# EasyEDA schematic SCH_cherry1_2026-04-12.json
TITLE: Sheet_1; REV: 1.0; Date: 2026-04-12; Sheet: 1/1; Drawn By: eda_wlhfflwl; Company: Your Company
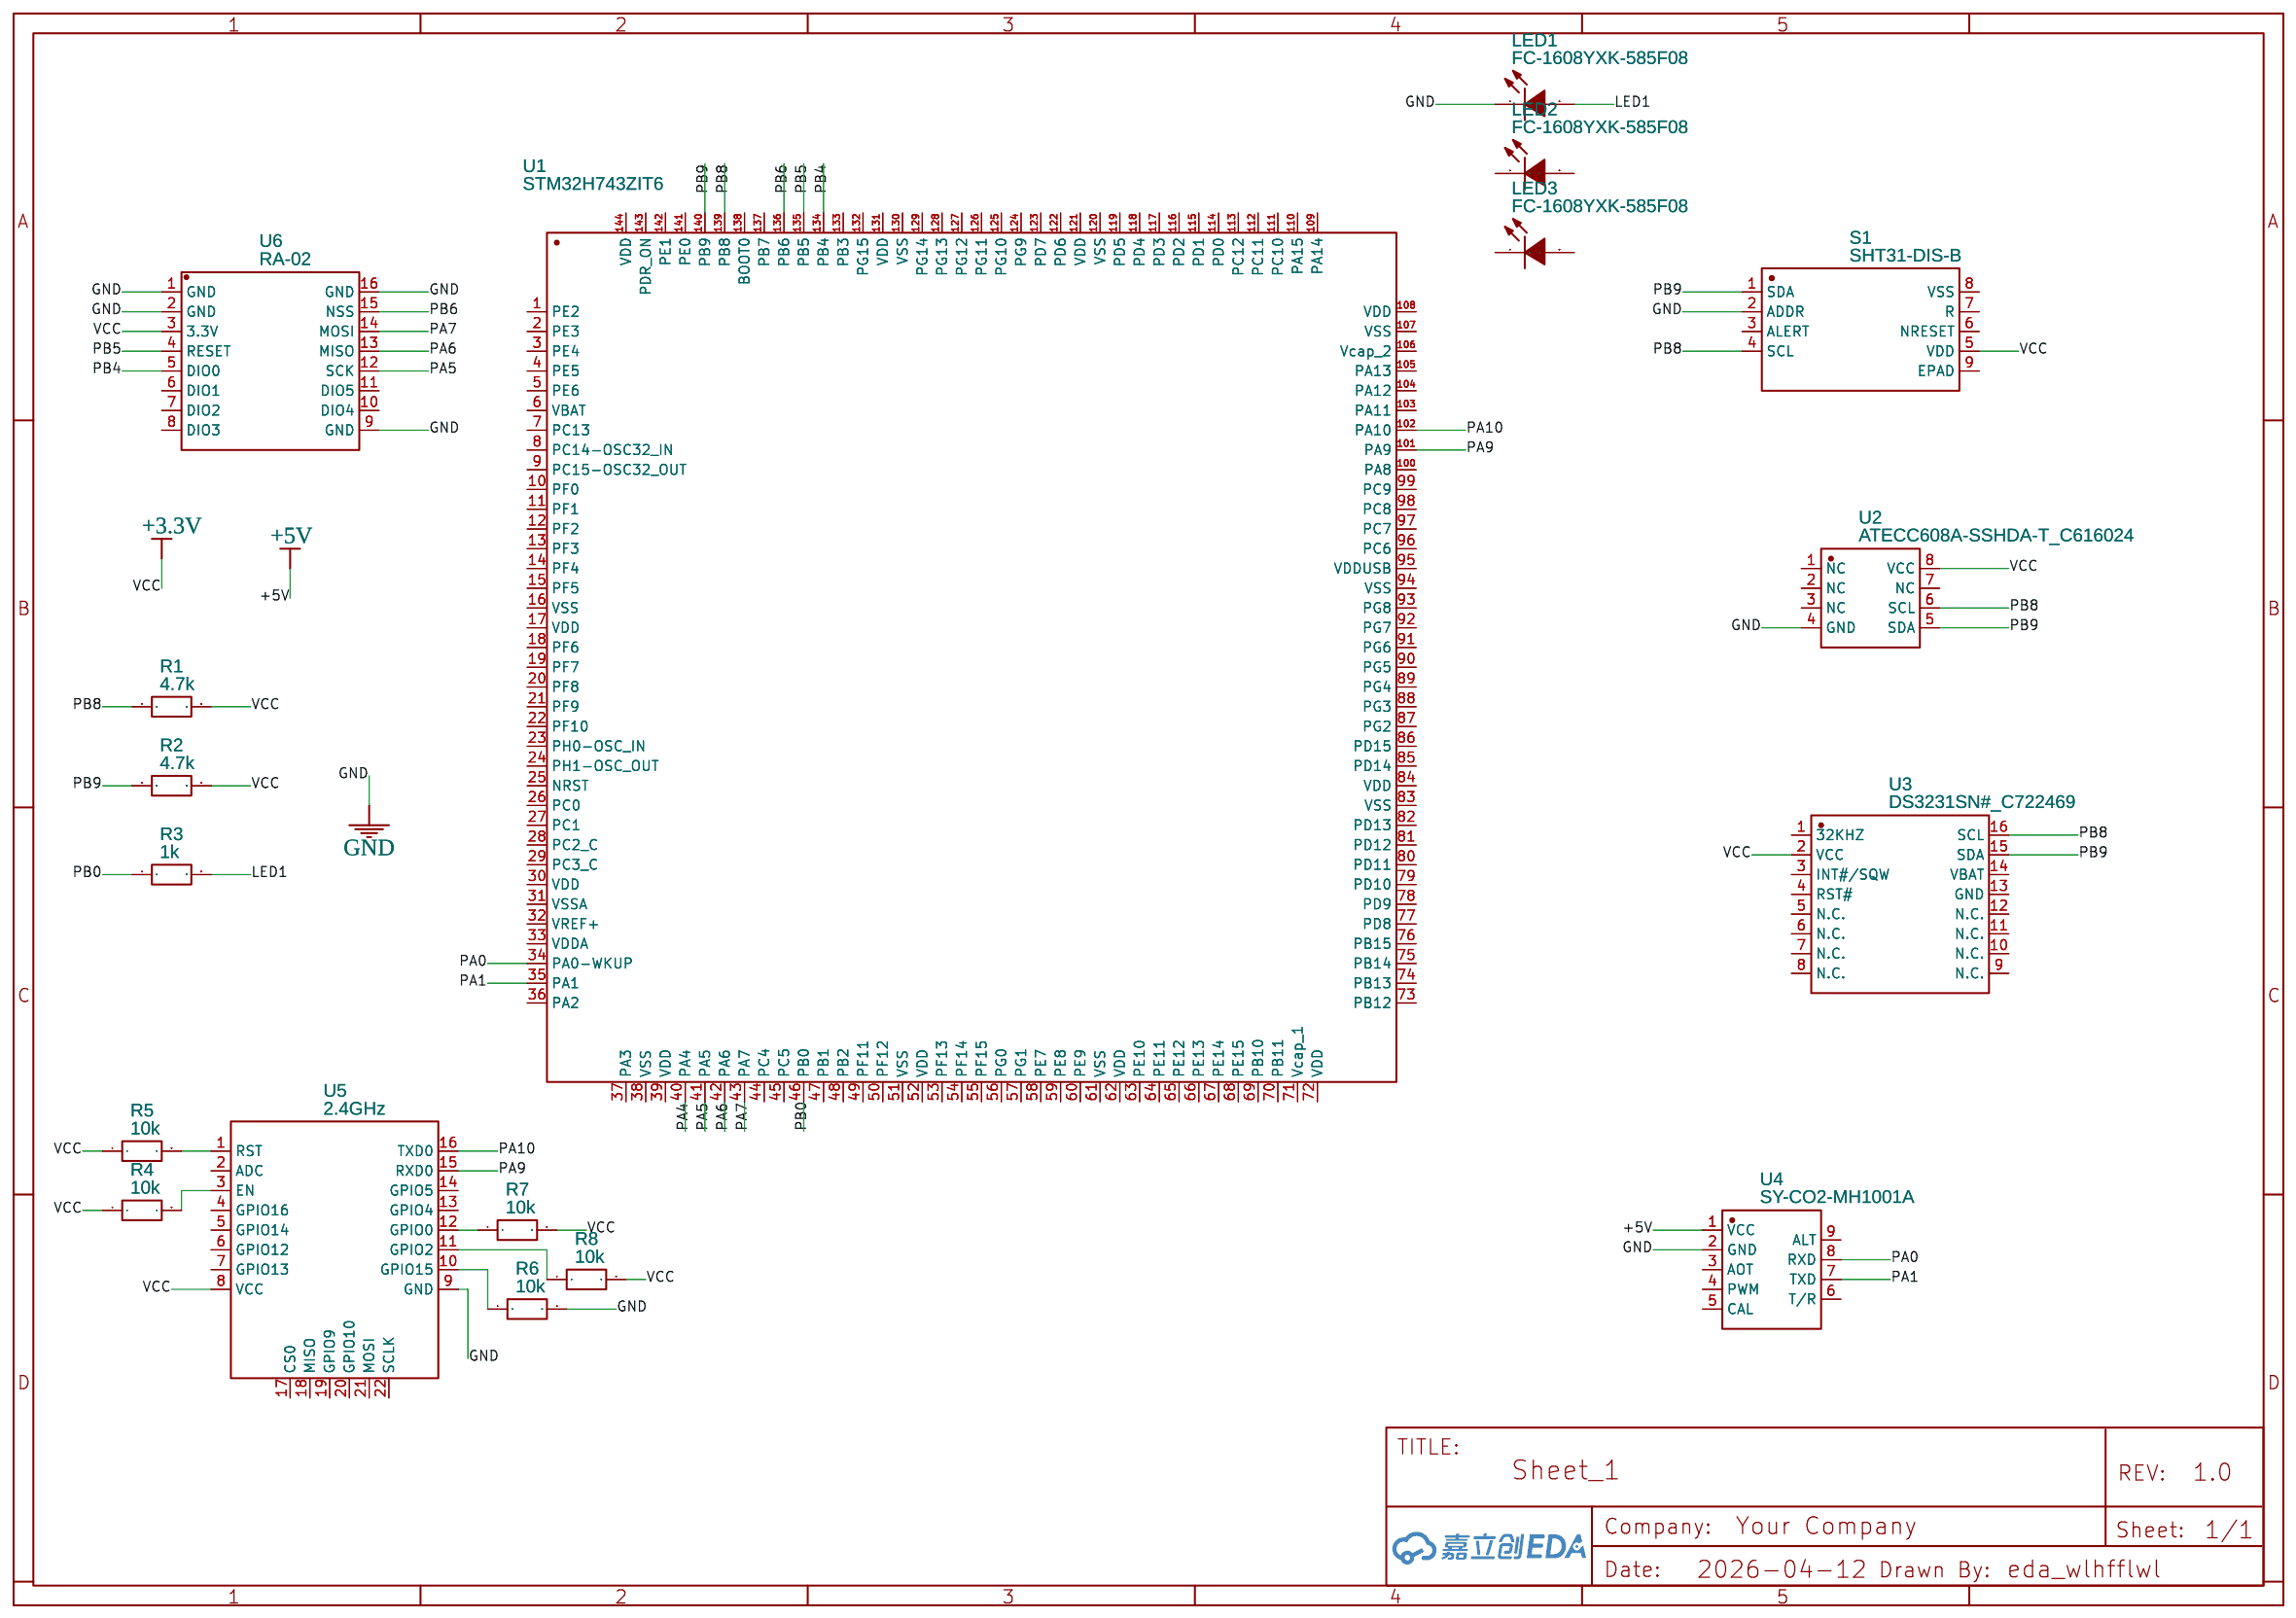
[diagram p0: schematic sheet]

## Parts
LED1  FC-1608YXK-585F08  [LED0603-RD]
LED2  FC-1608YXK-585F08  [LED0603-RD]
LED3  FC-1608YXK-585F08  [LED0603-RD]
R1  4.7k  [R0603]
R2  4.7k  [R0603]
R3  1k  [R0603]
R4  10k  [R0603]
R5  10k  [R0603]
R6  10k  [R0603]
R7  10k  [R0603]
R8  10k  [R0603]
S1  SHT31-DIS-B  [DFN-8_L2.5-W2.5-P0.50-BL-EP]
U1  STM32H743ZIT6  [LQFP-144_L20.0-W20.0-P0.50-LS22.0-BL]
U2  ATECC608A-SSHDA-T_C616024  [SOIC-8_L4.9-W3.9-P1.27-LS6.0-BL]
U3  DS3231SN#_C722469  [SOIC-16_L10.3-W7.5-P1.27-LS10.3-BL]
U4  SY-CO2-MH1001A  [SENSOR-TH_SY-CO2-MH1001A]
U5  2.4GHz  [WIFIM-SMD_ESP-12F-ESP8266MOD]
U6  RA-02  [WIRELM-SMD_RA-02-BL]

## Library data of the parts
LED1-LED3 = FC-1608YXK-585F08: Contributor: LCSC; Supplier: LCSC; Manufacturer: 国星光电; Manufacturer Part: NCD0603Y2; Supplier Part: C89811; JLCPCB Part Class: Extended Part
R1-R8 = R_0603_EU: Contributor: LCEDA_Lib
S1 = SHT31-DIS-B: Supplier: LCSC; Manufacturer Part: SHT31-DIS-B2.5kS; Manufacturer: Sensirion(瑞士盛思锐); Supplier Part: C80862; JLCPCB Part Class: Extended Part
U1 = STM32H743ZIT6: Contributor: LCSC; Supplier: LCSC; Manufacturer: ST(意法半导体); Supplier Part: C114408; JLCPCB Part Class: Extended Part; Package Display: No
U2 = ATECC608A-SSHDA-T_C616024: Contributor: LCSC; Supplier: LCSC; Supplier Part: C616024; Manufacturer: MICROCHIP(美国微芯); Manufacturer Part: ATECC608A-SSHDA-T; JLCPCB Part Class: Extended Part
U3 = DS3231SN#_C722469: Contributor: lcsc; Supplier: LCSC; Supplier Part: C722469; Manufacturer: ADI(亚德诺)/MAXIM(美信); Manufacturer Part: DS3231SN#; JLCPCB Part Class: Extended Part
U4 = SY-CO2-MH1001A: Supplier: LCSC; Supplier Part: C22466760; Manufacturer: saiya(赛亚); Manufacturer Part: SY-CO2-28BMI; Contributor: lcsc; JLCPCB Part Class: Extended Part
U5 = ESP-12F(ESP8266MOD): Supplier: LCSC; Manufacturer: Ai-Thinker(安信可); Supplier Part: C82891; JLCPCB Part Class: Extended Part
U6 = RA-02: Contributor: LCSC; Supplier: LCSC; Supplier Part: C90039; Manufacturer: Ai-Thinker(安信可); Manufacturer Part: Ra-02; JLCPCB Part Class: Extended Part

## Nets
+3.3V: R1.2 R2.2 R4.1 R5.1 R7.2 R8.2 S1.5(VDD) U2.8(VCC) U3.2(VCC) U5.8(VCC) U6.3(3.3V)
+5V: U4.1(VCC)
GND: LED1.1(K) R6.2 S1.2(ADDR) U2.4(GND) U4.2(GND) U5.9(GND) U6.1(GND) U6.2(GND) U6.9(GND) U6.16(GND)
LED1: LED1.2(A) R3.2
PA0: U1.34(PA0-WKUP) U4.8(RXD)
PA1: U1.35(PA1) U4.7(TXD)
PA4: U1.40(PA4)
PA5: U1.41(PA5) U6.12(SCK)
PA6: U1.42(PA6) U6.13(MISO)
PA7: U1.43(PA7) U6.14(MOSI)
PA9: U1.101(PA9) U5.15(RXD0)
PA10: U1.102(PA10) U5.16(TXD0)
PB0: R3.1 U1.46(PB0)
PB4: U1.134(PB4) U6.5(DIO0)
PB5: U1.135(PB5) U6.4(RESET)
PB6: U1.136(PB6) U6.15(NSS)
PB8: R1.1 S1.4(SCL) U1.139(PB8) U2.6(SCL) U3.16(SCL)
PB9: R2.1 S1.1(SDA) U1.140(PB9) U2.5(SDA) U3.15(SDA)
Net-(R4-2): R4.2 U5.3(EN)
Net-(R5-2): R5.2 U5.1(RST)
Net-(R6-1): R6.1 U5.10(GPIO15)
Net-(R7-1): R7.1 U5.12(GPIO0)
Net-(R8-1): R8.1 U5.11(GPIO2)

Not connected (* = marked no-connect by the designer): LED2 1(K) 2(A); LED3 1(K) 2(A); S1 3(ALERT) 6(NRESET) 7(R) 8(VSS) 9(EPAD); U1 1(PE2) 2(PE3) 3(PE4) 4(PE5) 5(PE6) 6(VBAT) 7(PC13) 8(PC14-OSC32_IN) 9(PC15-OSC32_OUT) 10(PF0) 11(PF1) 12(PF2) 13(PF3) 14(PF4) 15(PF5) 16(VSS) 17(VDD) 18(PF6) 19(PF7) 20(PF8) 21(PF9) 22(PF10) 23(PH0-OSC_IN) 24(PH1-OSC_OUT) 25(NRST) 26(PC0) 27(PC1) 28(PC2_C) 29(PC3_C) 30(VDD) 31(VSSA) 32(VREF+) 33(VDDA) 36(PA2) 37(PA3) 38(VSS) 39(VDD) 44(PC4) 45(PC5) 47(PB1) 48(PB2) 49(PF11) 50(PF12) 51(VSS) 52(VDD) 53(PF13) 54(PF14) 55(PF15) 56(PG0) 57(PG1) 58(PE7) 59(PE8) 60(PE9) 61(VSS) 62(VDD) 63(PE10) 64(PE11) 65(PE12) 66(PE13) 67(PE14) 68(PE15) 69(PB10) 70(PB11) 71(Vcap_1) 72(VDD) 73(PB12) 74(PB13) 75(PB14) 76(PB15) 77(PD8) 78(PD9) 79(PD10) 80(PD11) 81(PD12) 82(PD13) 83(VSS) 84(VDD) 85(PD14) 86(PD15) 87(PG2) 88(PG3) 89(PG4) 90(PG5) 91(PG6) 92(PG7) 93(PG8) 94(VSS) 95(VDDUSB) 96(PC6) 97(PC7) 98(PC8) 99(PC9) 100(PA8) 103(PA11) 104(PA12) 105(PA13) 106(Vcap_2) 107(VSS) 108(VDD) 109(PA14) 110(PA15) 111(PC10) 112(PC11) 113(PC12) 114(PD0) 115(PD1) 116(PD2) 117(PD3) 118(PD4) 119(PD5) 120(VSS) 121(VDD) 122(PD6) 123(PD7) 124(PG9) 125(PG10) 126(PG11) 127(PG12) 128(PG13) 129(PG14) 130(VSS) 131(VDD) 132(PG15) 133(PB3) 137(PB7) 138(BOOT0) 141(PE0) 142(PE1) 143(PDR_ON) 144(VDD); U2 1(NC) 2(NC) 3(NC) 7(NC); U3 1(32KHZ) 3(INT#/SQW) 4(RST#) 5(N.C.) 6(N.C.) 7(N.C.) 8(N.C.) 9(N.C.) 10(N.C.) 11(N.C.) 12(N.C.) 13(GND) 14(VBAT); U4 3(AOT) 4(PWM) 5(CAL) 6(T/R) 9(ALT); U5 2(ADC) 4(GPIO16) 5(GPIO14) 6(GPIO12) 7(GPIO13) 13(GPIO4) 14(GPIO5) 17(CS0) 18(MISO) 19(GPIO9) 20(GPIO10) 21(MOSI) 22(SCLK); U6 6(DIO1) 7(DIO2) 8(DIO3) 10(DIO4) 11(DIO5)
